# EAGLE design board_v1 (EAGLE 9.4.0)
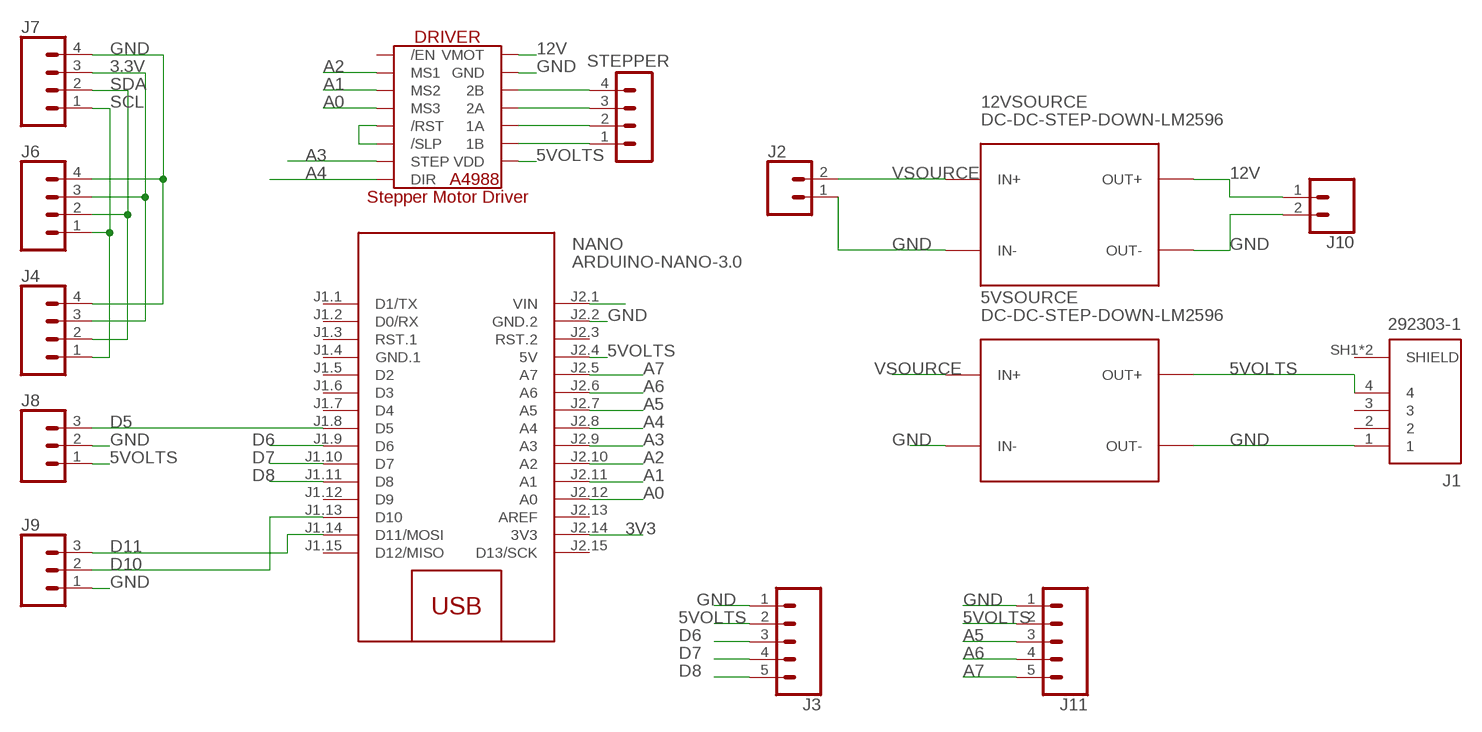
[diagram p0: schematic, sheet 1]

## Parts
5VSOURCE  DC-DC-STEP-DOWN-LM2596  [DC-DC-STEP-DOWN-LM2596]
12VSOURCE  DC-DC-STEP-DOWN-LM2596  [DC-DC-STEP-DOWN-LM2596]
DRIVER  A4988_STEP  [A4988_STEP]
J1  292303-1  [292303-1]
J2  CONN_025MM  [SCREWTERMINAL-5MM-2]
J3  CONN_05  [1X05]
J4  CONN_04POLAR  [MOLEX-1X4]
J6  CONN_04POLAR  [MOLEX-1X4]
J7  CONN_04POLAR  [MOLEX-1X4]
J8  CONN_03POLAR  [MOLEX-1X3]
J9  CONN_03POLAR  [MOLEX-1X3]
J10  CONN_025MM  [SCREWTERMINAL-5MM-2]
J11  CONN_05  [1X05]
NANO  ARDUINO-NANO-3.0  [ARDUINO-NANO-3.0]
STEPPER  MA04-1  [MA04-1]

## Nets
3.3V: J4.3 J6.3 J7.3
3V3: NANO.J2.14(3V3)
5VOLTS: 5VSOURCE.OUT+ DRIVER.VDD J1.4 J3.2 J8.1 J11.2 NANO.J2.4(5V)
12V: 12VSOURCE.OUT+ DRIVER.VMOT J10.1
A0: DRIVER.MS3 NANO.J2.12(A0)
A1: DRIVER.MS2 NANO.J2.11(A1)
A2: DRIVER.MS1 NANO.J2.10(A2)
A3: DRIVER.STEP NANO.J2.9(A3)
A4: DRIVER.DIR NANO.J2.8(A4)
A5: J11.3 NANO.J2.7(A5)
A6: J11.4 NANO.J2.6(A6)
A7: J11.5 NANO.J2.5(A7)
D5: J8.3 NANO.J1.8(D5)
D6: J3.3 NANO.J1.9(D6)
D7: J3.4 NANO.J1.10(D7)
D8: J3.5 NANO.J1.11(D8)
D10: J9.2 NANO.J1.13(D10)
D11: J9.3 NANO.J1.14(D11/MOSI)
GND: 5VSOURCE.IN- 5VSOURCE.OUT- 12VSOURCE.IN- 12VSOURCE.OUT- DRIVER.GND DRIVER.GND2(GND) J1.1 J2.1 J3.1 J4.4 J6.4 J7.4 J8.2 J9.1 J10.2 J11.1 NANO.J2.2(GND.2)
N$1: NANO.J2.1(VIN)
N$2: DRIVER.2B STEPPER.4
N$6: DRIVER.2A STEPPER.3
N$7: DRIVER.1A STEPPER.2
N$8: DRIVER.1B STEPPER.1
N$10: DRIVER./RST DRIVER./SLP
SCL: J4.1 J6.1 J7.1
SDA: J4.2 J6.2 J7.2
VSOURCE: 5VSOURCE.IN+ 12VSOURCE.IN+ J2.2
Unconnected: DRIVER./EN J1.2 J1.3 NANO.J1.1(D1/TX) NANO.J1.2(D0/RX) NANO.J1.3(RST.1) NANO.J1.5(D2) NANO.J1.6(D3) NANO.J1.7(D4) NANO.J1.12(D9) NANO.J1.15(D12/MISO) NANO.J2.3(RST.2) NANO.J2.13(AREF) NANO.J2.15(D13/SCK)

## Power pins joined to a net without a drawn wire
GND.1: NANO.J1.4(GND.1)
SHIELD: J1.SH1(SHIELD) J1.SH2(SHIELD)

## Library data of the parts
5VSOURCE 12VSOURCE = diy-modules:DC-DC-STEP-DOWN-LM2596: DC/DC Step-Down Regulator based on LM2596-ADJ chip LM2596 datasheet available here: http://www.ti.com/lit/ds/symlink/lm2596.pdf Click here to find device on ebay.com <http://www.ebay.com/sch/lm2596+power+regulator>
DRIVER = IC:A4988_STEP
J1 = USB connector:292303-1: CONN RCPT USB2.0 TYPEA 4POS R/A Manufacturer's datasheet <https://www.te.com/commerce/DocumentDelivery/DDEController?Action=srchrtrv&DocNm=292303&DocType=Customer+Drawing&DocLang=English>; CREATED_BY: PCBLayout.com; DIGIKEY_PARTNO: A31726-ND; MANUFACTURER: TE Connectivity AMP Connectors; MPN: 292303-1
J2 J10 = SparkFun-Connectors:CONN_02: Multi connection point. Often used as Generic Header-pin footprint for 0.1 inch spaced/style header connections On any of the 0.1 inch spaced packages, you can populate with these: Break Away Headers - Straight <https://www.sparkfun.com/products/116> (PRT-00116) Break Away Male Headers - Right Angle <https://www.sparkfun.com/products/553> (PRT-00553) Female Headers <https://www.sparkfun.com/products/115> (PRT-00115) Break Away Headers - Machine Pin <https://www.sparkfun.com/products/117> (PRT-00117) Break Away Female Headers - Swiss Machine Pin <https://www.sparkfun.com/products/743> (PRT-00743) For SCREWTERMINALS and SPRING TERMINALS visit here: Screw Terimnals on SparkFun.com <https://www.sparkfun.com/search/results?term=Screw+Terminals> (5mm/3.5mm/2.54mm spacing) This device is also useful as a general connection point to wire up your design to another part of your project. Our various solder wires solder well into these plated through hole pads. Hook-Up Wire - Assortment (Stranded, 22 AWG) <https://www.sparkfun.com/products/11375> (PRT-11375) Hook-Up Wire - Assortment (Solid Core, 22 AWG) <https://www.sparkfun.com/products/11367> (PRT-11367) View the entire wire category on our website here <https://www.sparkfun.com/categories/141> Special notes: Molex polarized connector foot print use with: PRT-08233 with associated crimp pins and housings. 2.54_SCREWTERM for use with PRT-10571. 3.5mm Screw Terminal footprints for PRT-08084 5mm Screw Terminal footprints for use with PRT-08432; SF_SKU: PRT-08432
J3 J11 = SparkFun-Connectors:CONN_05: Multi connection point. Often used as Generic Header-pin footprint for 0.1 inch spaced/style header connections On any of the 0.1 inch spaced packages, you can populate with these: Break Away Headers - Straight <https://www.sparkfun.com/products/116> (PRT-00116) Break Away Male Headers - Right Angle <https://www.sparkfun.com/products/553> (PRT-00553) Female Headers <https://www.sparkfun.com/products/115> (PRT-00115) Break Away Headers - Machine Pin <https://www.sparkfun.com/products/117> (PRT-00117) Break Away Female Headers - Swiss Machine Pin <https://www.sparkfun.com/products/743> (PRT-00743) For SCREWTERMINALS and SPRING TERMINALS visit here: Screw Terimnals on SparkFun.com <https://www.sparkfun.com/search/results?term=Screw+Terminals> (5mm/3.5mm/2.54mm spacing) This device is also useful as a general connection point to wire up your design to another part of your project. Our various solder wires solder well into these plated through hole pads. Hook-Up Wire - Assortment (Stranded, 22 AWG) <https://www.sparkfun.com/products/11375> (PRT-11375) Hook-Up Wire - Assortment (Solid Core, 22 AWG) <https://www.sparkfun.com/products/11367> (PRT-11367) View the entire wire category on our website here <https://www.sparkfun.com/categories/141> Special notes: Molex polarized connector foot print use with SKU : PRT-08231 with associated crimp pins and housings. 1MM SMD Version SKU: PRT-10208
J4 J6 J7 = SparkFun-Connectors:CONN_04: Multi connection point. Often used as Generic Header-pin footprint for 0.1 inch spaced/style header connections On any of the 0.1 inch spaced packages, you can populate with these: Break Away Headers - Straight <https://www.sparkfun.com/products/116> (PRT-00116) Break Away Male Headers - Right Angle <https://www.sparkfun.com/products/553> (PRT-00553) Female Headers <https://www.sparkfun.com/products/115> (PRT-00115) Break Away Headers - Machine Pin <https://www.sparkfun.com/products/117> (PRT-00117) Break Away Female Headers - Swiss Machine Pin <https://www.sparkfun.com/products/743> (PRT-00743) For SCREWTERMINALS and SPRING TERMINALS visit here: Screw Terimnals on SparkFun.com <https://www.sparkfun.com/search/results?term=Screw+Terminals> (5mm/3.5mm/2.54mm spacing) This device is also useful as a general connection point to wire up your design to another part of your project. Our various solder wires solder well into these plated through hole pads. Hook-Up Wire - Assortment (Stranded, 22 AWG) <https://www.sparkfun.com/products/11375> (PRT-11375) Hook-Up Wire - Assortment (Solid Core, 22 AWG) <https://www.sparkfun.com/products/11367> (PRT-11367) View the entire wire category on our website here <https://www.sparkfun.com/categories/141> Special notes: Molex polarized connector foot print use with SKU : PRT-08231 with associated crimp pins and housings. 1MM SMD Version SKU: PRT-10208; PROD_ID: CONN-08186; SF_ID: PRT-08231
J8 J9 = SparkFun-Connectors:CONN_03: Multi connection point. Often used as Generic Header-pin footprint for 0.1 inch spaced/style header connections On any of the 0.1 inch spaced packages, you can populate with these: Break Away Headers - Straight <https://www.sparkfun.com/products/116> (PRT-00116) Break Away Male Headers - Right Angle <https://www.sparkfun.com/products/553> (PRT-00553) Female Headers <https://www.sparkfun.com/products/115> (PRT-00115) Break Away Headers - Machine Pin <https://www.sparkfun.com/products/117> (PRT-00117) Break Away Female Headers - Swiss Machine Pin <https://www.sparkfun.com/products/743> (PRT-00743) Stackable Header - 3 Pin (Female, 0.1") <https://www.sparkfun.com/products/13875> (PRT-13875) For SCREWTERMINALS and SPRING TERMINALS visit here: Screw Terimnals on SparkFun.com <https://www.sparkfun.com/search/results?term=Screw+Terminals> (5mm/3.5mm/2.54mm spacing) This device is also useful as a general connection point to wire up your design to another part of your project. Our various solder wires solder well into these plated through hole pads. Hook-Up Wire - Assortment (Stranded, 22 AWG) <https://www.sparkfun.com/products/11375> (PRT-11375) Hook-Up Wire - Assortment (Solid Core, 22 AWG) <https://www.sparkfun.com/products/11367> (PRT-11367) View the entire wire category on our website here <https://www.sparkfun.com/categories/141> Special notes: Molex polarized connector foot print use with SKU : PRT-08232 with associated crimp pins and housings.; PROD_ID: CONN-08625; SF_ID: PRT-08096
NANO = diy-modules:ARDUINO-NANO-3.0: Arduino Nano 3.0 and compatible devices More details available here: https://www.arduino.cc/en/Main/ArduinoBoardNano Click here to find device on ebay.com <http://www.ebay.com/sch/arduino+nano>
STEPPER = con-lstb:MA04-1: PIN HEADER; OC_FARNELL: unknown; OC_NEWARK: unknown

## Board
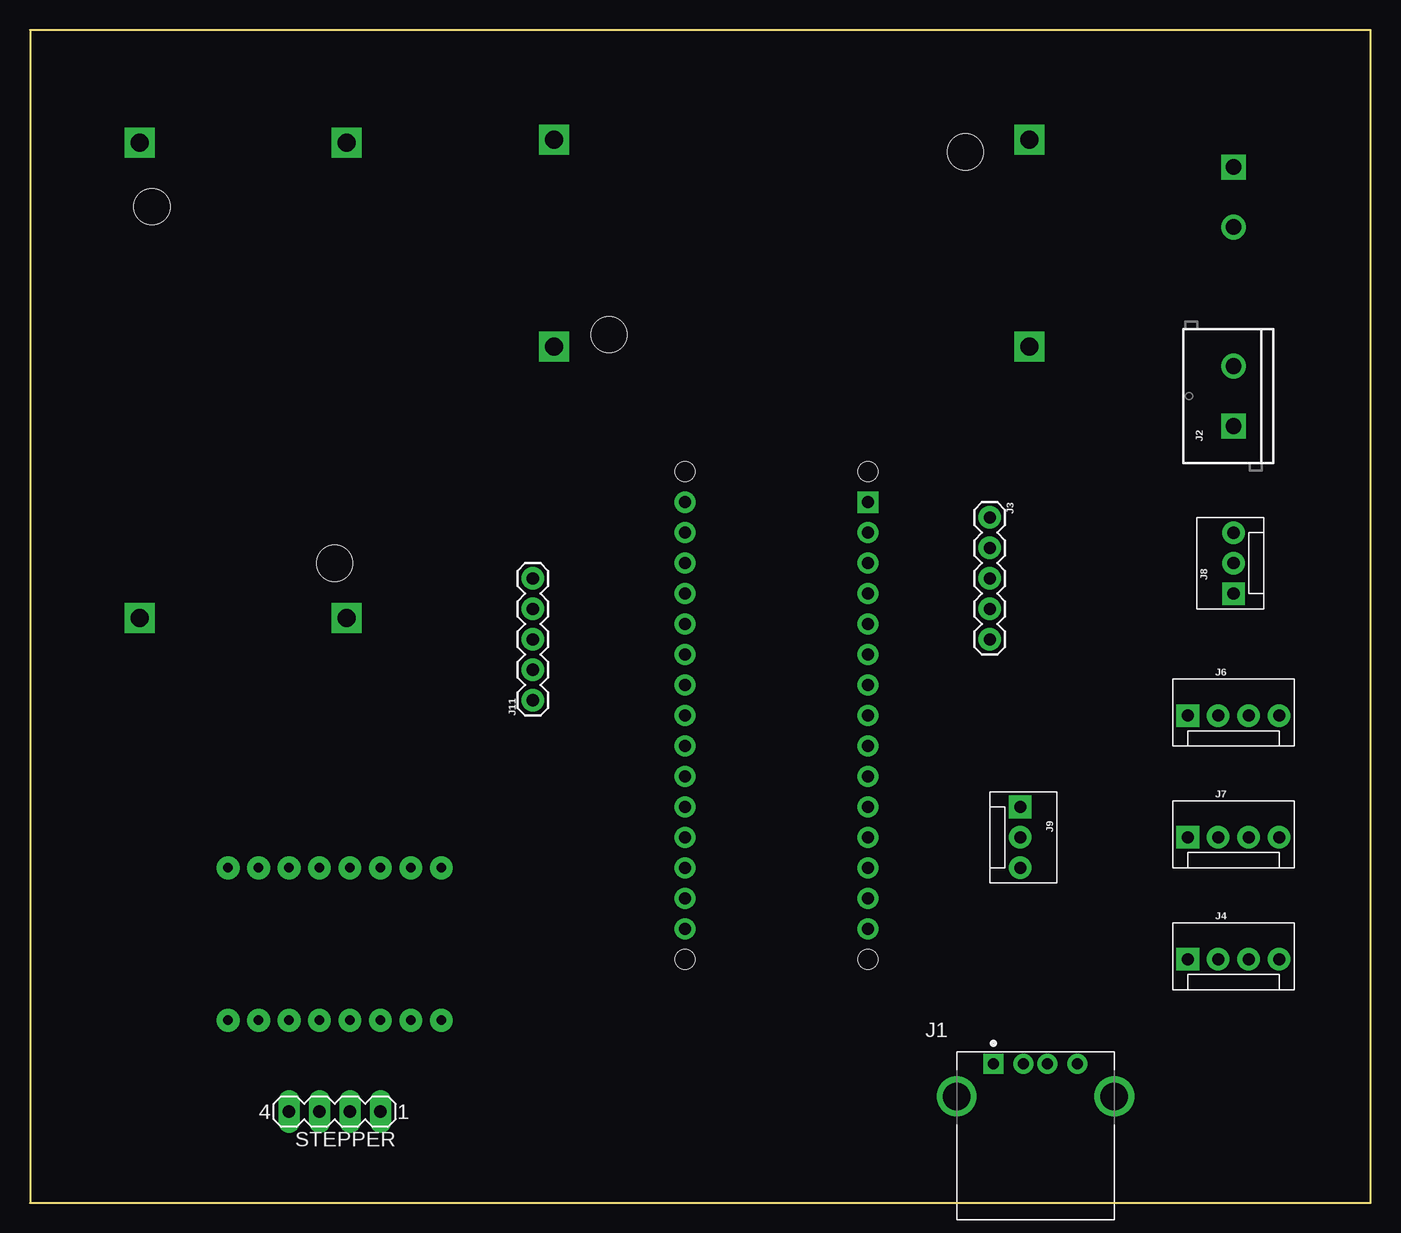
[diagram p1: board, top side]
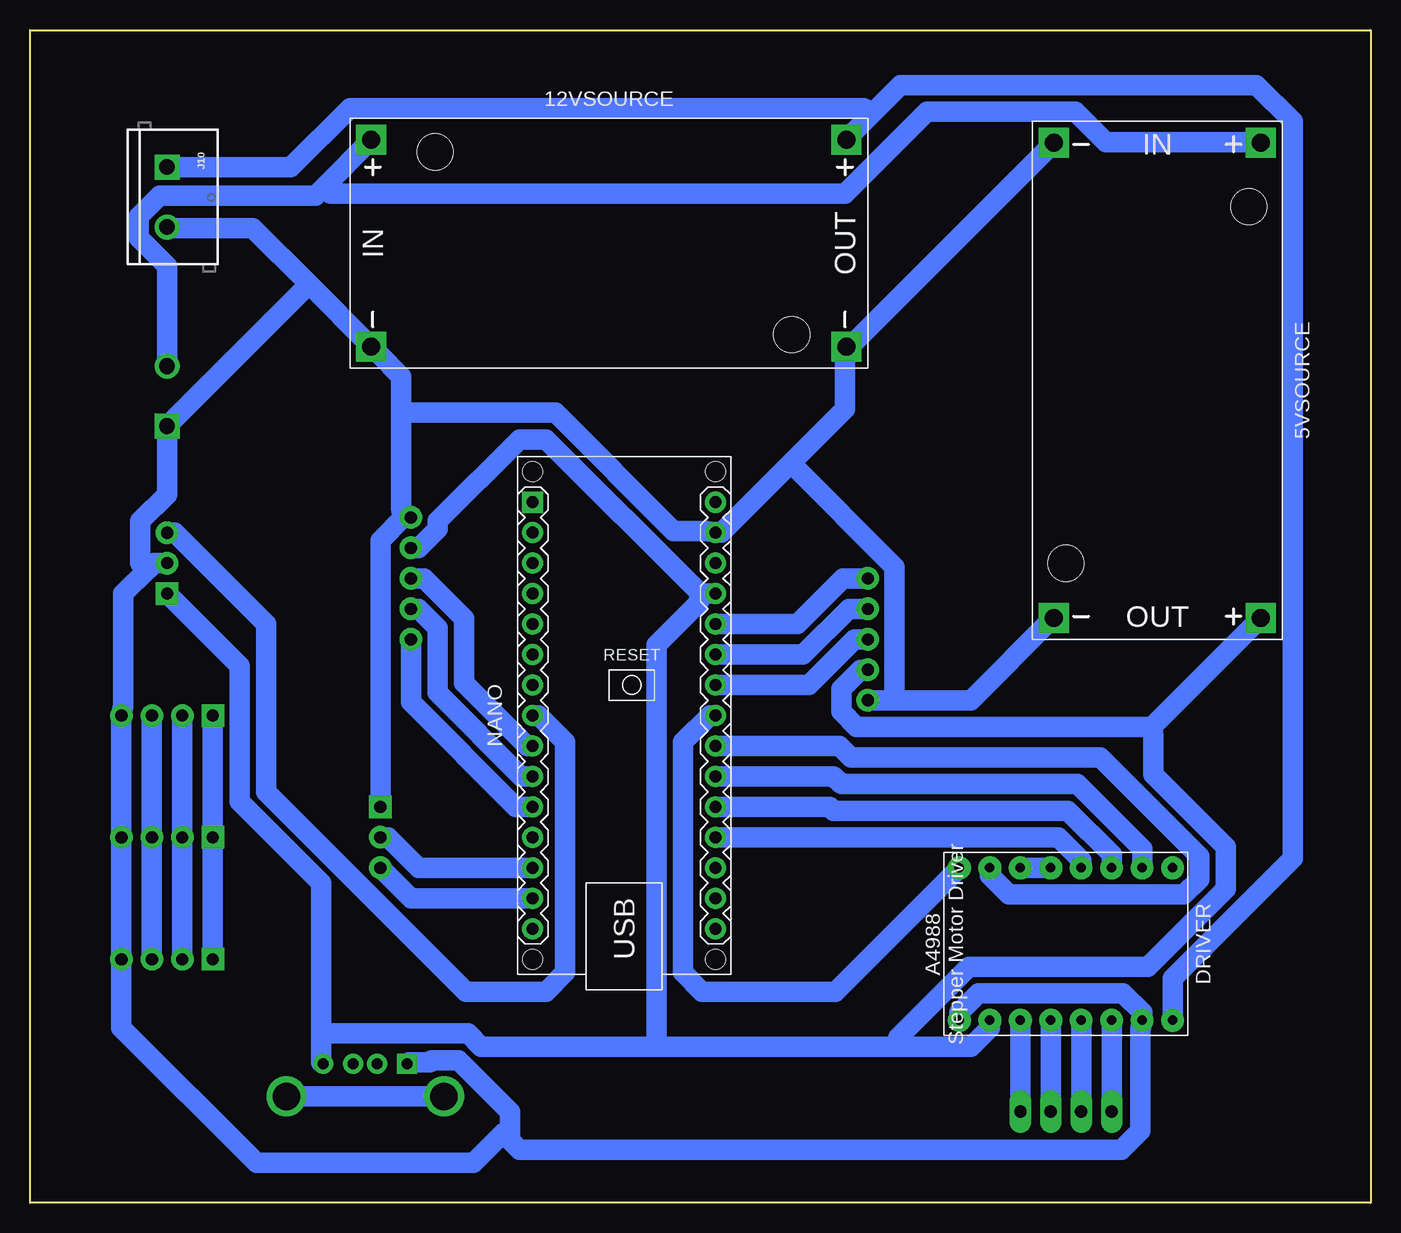
[diagram p2: board, bottom side, seen from below]

Size 111.76 x 97.79 mm. Coordinates in mm from the lower left corner, seen from the top.
Outline: 0,97.79 0,0 111.76,0 111.76,97.79 0,97.79
Copper layers (1*16): Top 0.035mm / dielectric 1.5mm / Bottom 0.035mm
Design rules "default *": minimum track width 1.7mm, minimum drill 0.8mm, track to track 0.4mm, track to pad 0.4mm, pad to pad 0.4mm, via to via 0.4mm, smd to smd 6mil, copper to edge 40mil, drill to drill 6mil, minimum pad ring 15mil, minimum via ring 8mil, stop-mask expansion 4mil, vias tented up to drill 0mil, thermal gap 10mil

### Footprints (pad centres in the part's own frame; a part is rotated, then mirrored left to right if it is on the bottom)
DC-DC-STEP-DOWN-LM2596 = drill 1.5 pad 2.5 square: IN+ -19.812,8.636; IN- -19.812,-8.636; OUT+ 19.812,8.636; OUT- 19.812,-8.636 | hole 3: -14.478,7.62; 15.24,-7.62
A4988_STEP = drill 0.8 pad 1.905: 1A 6.35,-1.27; 1B 6.35,-3.81; 2A 6.35,1.27; 2B 6.35,3.81; /EN -6.35,8.89; /RST -6.35,-1.27; /SLP -6.35,-3.81; DIR -6.35,-8.89; GND 6.35,6.35; GND2 6.35,-8.89; MS1 -6.35,6.35; MS2 -6.35,3.81; MS3 -6.35,1.27; STEP -6.35,-6.35; VDD 6.35,-6.35; VMOT 6.35,8.89
292303-1 = drill 0.92 square: 1 -3.5,2.71 | drill 0.92: 2 -1,2.71; 3 1,2.71; 4 3.5,2.71 | drill 2.3: SH1 -6.57,0; SH2 6.57,0
SCREWTERMINAL-5MM-2 = drill 1.3 pad 2.032 square: 1 0,0 | drill 1.3 pad 2.032: 2 5,0
1X05 = drill 1.016 pad 1.88: 1 0,0; 2 2.54,0; 3 5.08,0; 4 7.62,0; 5 10.16,0
MOLEX-1X4 = drill 1.016 pad 1.88 square: 1 0,0 | drill 1.016 pad 1.88: 2 2.54,0; 3 5.08,0; 4 7.62,0
MOLEX-1X3 = drill 1.016 pad 1.88 square: 1 0,0 | drill 1.016 pad 1.88: 2 2.54,0; 3 5.08,0
ARDUINO-NANO-3.0 = drill 1 square: J1.1 17.78,7.62 | drill 1: J1.2 15.24,7.62; J1.3 12.7,7.62; J1.4 10.16,7.62; J1.5 7.62,7.62; J1.6 5.08,7.62; J1.7 2.54,7.62; J1.8 0,7.62; J1.9 -2.54,7.62; J1.10 -5.08,7.62; J1.11 -7.62,7.62; J1.12 -10.16,7.62; J1.13 -12.7,7.62; J1.14 -15.24,7.62; J1.15 -17.78,7.62; J2.1 17.78,-7.62; J2.2 15.24,-7.62; J2.3 12.7,-7.62; J2.4 10.16,-7.62; J2.5 7.62,-7.62; J2.6 5.08,-7.62; J2.7 2.54,-7.62; J2.8 0,-7.62; J2.9 -2.54,-7.62; J2.10 -5.08,-7.62; J2.11 -7.62,-7.62; J2.12 -10.16,-7.62; J2.13 -12.7,-7.62; J2.14 -15.24,-7.62; J2.15 -17.78,-7.62 | hole 1.651: -20.32,7.62; -20.32,-7.62; 20.32,-7.62; 20.32,7.62
MA04-1 = drill 1.016 long: 1 -3.81,0; 2 -1.27,0; 3 1.27,0; 4 3.81,0

### Placement (x,y rotation side)
5VSOURCE  17.78,68.58 270 bottom
12VSOURCE  63.5,80.01 0 bottom
DRIVER  25.4,21.59 270 bottom
J1  83.82,8.89 0 top
J2  100.33,64.77 90 top
J3  80.01,57.15 270 top
J4  96.52,20.32 0 top
J6  96.52,40.64 0 top
J7  96.52,30.48 0 top
J8  100.33,50.8 90 top
J9  82.55,33.02 270 top
J10  100.33,86.36 270 bottom
J11  41.91,41.91 90 top
NANO  62.23,40.64 90 bottom
STEPPER  25.4,7.62 180 top

### Tracks (layer width: path | path; a pad name or v marks a point on that pad's centre or on a via)
3.3V
  Bottom 1.7: J4.3 J7.3 J6.3
5VOLTS
  Bottom 1.7: J11.2 42.55,44.45 44.13,42.86 44.13,40.96 42.86,39.69 18.26,39.69 | 18.26,39.69 9.21,48.74 5VSOURCE.OUT+ | 55.88,50.8 NANO.J2.4 | 55.88,50.8 68.74,63.66 70.96,63.66 77.79,56.83 77.79,56.2 79.38,54.61 J3.2 | 87.47,14.13 87.47,26.67 94.3,33.5 94.3,44.77 J8.1 | 87.47,14.13 87.47,11.75 J1.4 | DRIVER.VDD 31.75,14.6 33.34,13.02 39.37,13.02 | 59.53,13.02 74.14,13.02 75.25,14.13 87.47,14.13 | 59.53,13.02 39.37,13.02 | 59.53,13.02 59.53,46.51 56.04,50.01 55.88,50.8 | 18.26,39.69 18.1,38.89 18.1,35.72 12.06,29.69 12.06,26.19 18.57,19.69 33.5,19.69 39.37,13.81 39.37,13.02
12V
  Bottom 1.7: DRIVER.VMOT 16.51,18.73 6.51,28.73 6.51,90.17 9.52,93.19 39.21,93.19 41.67,90.73 | 41.67,90.73 43.66,88.74 12VSOURCE.OUT+ | J10.1 90.01,86.36 85.09,91.28 42.23,91.28 41.67,90.73
A0
  Bottom 1.7: NANO.J2.12 26.04,30.48 24.13,28.57 DRIVER.MS3
A1
  Bottom 1.7: NANO.J2.11 45.08,33.02 44.77,32.7 25.24,32.7 21.59,29.05 DRIVER.MS2
A2
  Bottom 1.7: NANO.J2.10 44.77,35.56 44.13,34.92 24.45,34.92 19.05,29.53 DRIVER.MS1
A3
  Bottom 1.7: NANO.J2.9 44.29,38.1 43.34,37.15 22.54,37.15 14.29,28.89 14.29,26.99 15.56,25.72 30.16,25.72 31.75,27.3 DRIVER.STEP
A4
  Bottom 1.7: NANO.J2.8 55.09,40.64 57.31,38.42 57.31,19.21 55.72,17.62 44.61,17.62 DRIVER.DIR
A5
  Bottom 1.7: NANO.J2.7 46.83,43.18 43.02,46.99 J11.3
A6
  Bottom 1.7: NANO.J2.6 47.31,45.72 43.5,49.53 J11.4
A7
  Bottom 1.7: NANO.J2.5 47.78,48.26 43.97,52.07 J11.5
D5
  Bottom 1.7: NANO.J1.8 69.37,40.64 67.15,38.42 67.15,19.21 68.74,17.62 75.41,17.62 92.07,34.29 92.07,48.26 99.69,55.88 J8.3
D6
  Bottom 1.7: NANO.J1.9 70.33,38.1 75.56,43.34 75.56,48.74 78.9,52.07 J3.3
D7
  Bottom 1.7: NANO.J1.10 70.8,35.56 77.79,42.55 77.79,47.94 79.38,49.53 J3.4
D8
  Bottom 1.7: NANO.J1.11 71.28,33.02 80.01,41.75 J3.5
D10
  Bottom 1.7: NANO.J1.13 79.38,27.94 81.91,30.48 J9.2
D11
  Bottom 1.7: NANO.J1.14 80.01,25.4 J9.3
GND
  Bottom 1.7: 39.69,41.91 33.34,41.91 26.51,48.74 5VSOURCE.OUT- | 39.69,41.91 J11.1 | 48.34,61.67 43.81,66.2 43.81,71.28 12VSOURCE.OUT- 43.02,71.75 26.51,88.27 5VSOURCE.IN- | 48.34,61.67 54.13,55.88 NANO.J2.2 55.4,56.04 58.1,56.04 67.94,65.88 80.8,65.88 | 39.69,41.91 39.69,53.02 48.34,61.67 | J9.1 82.55,55.24 80.64,57.15 | J3.1 80.64,57.15 | 88.5,76.6 83.34,71.44 12VSOURCE.IN- 82.71,70.8 80.8,68.9 80.8,65.88 | 88.5,76.6 93.19,81.28 100.33,81.28 J10.2 | 80.8,65.88 80.8,57.94 80.64,57.15 | DRIVER.GND2 34.29,15.88 32.7,17.46 20.64,17.46 19.05,15.88 DRIVER.GND 19.21,14.45 19.21,6.03 20.8,4.44 70.96,4.44 71.75,5.24 | 71.75,5.24 71.75,7.62 76.04,11.91 78.26,11.91 78.42,11.75 80.17,11.75 J1.1 | J8.2 101.44,53.34 102,52.78 | 102,52.78 103.98,50.8 103.98,41.43 J6.4 J7.4 J4.4 104.14,14.6 92.87,3.33 74.77,3.33 72.31,5.79 71.75,5.24 | 102,52.78 102.55,53.34 102.55,56.83 100.33,59.05 J2.1 88.5,76.6
N$2
  Bottom 1.7: DRIVER.2B STEPPER.4
N$6
  Bottom 1.7: DRIVER.2A STEPPER.3
N$7
  Bottom 1.7: DRIVER.1A STEPPER.2
N$8
  Bottom 1.7: DRIVER.1B STEPPER.1
N$10
  Bottom 1.7: DRIVER./SLP DRIVER./RST
SCL
  Bottom 1.7: J4.1 J7.1 J6.1
SDA
  Bottom 1.7: J4.2 J7.2 J6.2
SHIELD
  Bottom 1.7: J1.SH2 J1.SH1
VSOURCE
  Bottom 1.7: J2.2 100.33,78.11 102.71,80.49 102.71,82.23 100.96,83.98 87.95,83.98 87.23,84.69 | 87.23,84.69 83.34,88.58 12VSOURCE.IN+ | 5VSOURCE.IN+ 9.21,88.42 22.07,88.42 24.61,90.96 36.99,90.96 43.81,84.14 86.68,84.14 87.23,84.69